# EAGLE design cartridge_pcb (EAGLE 9.5.2)
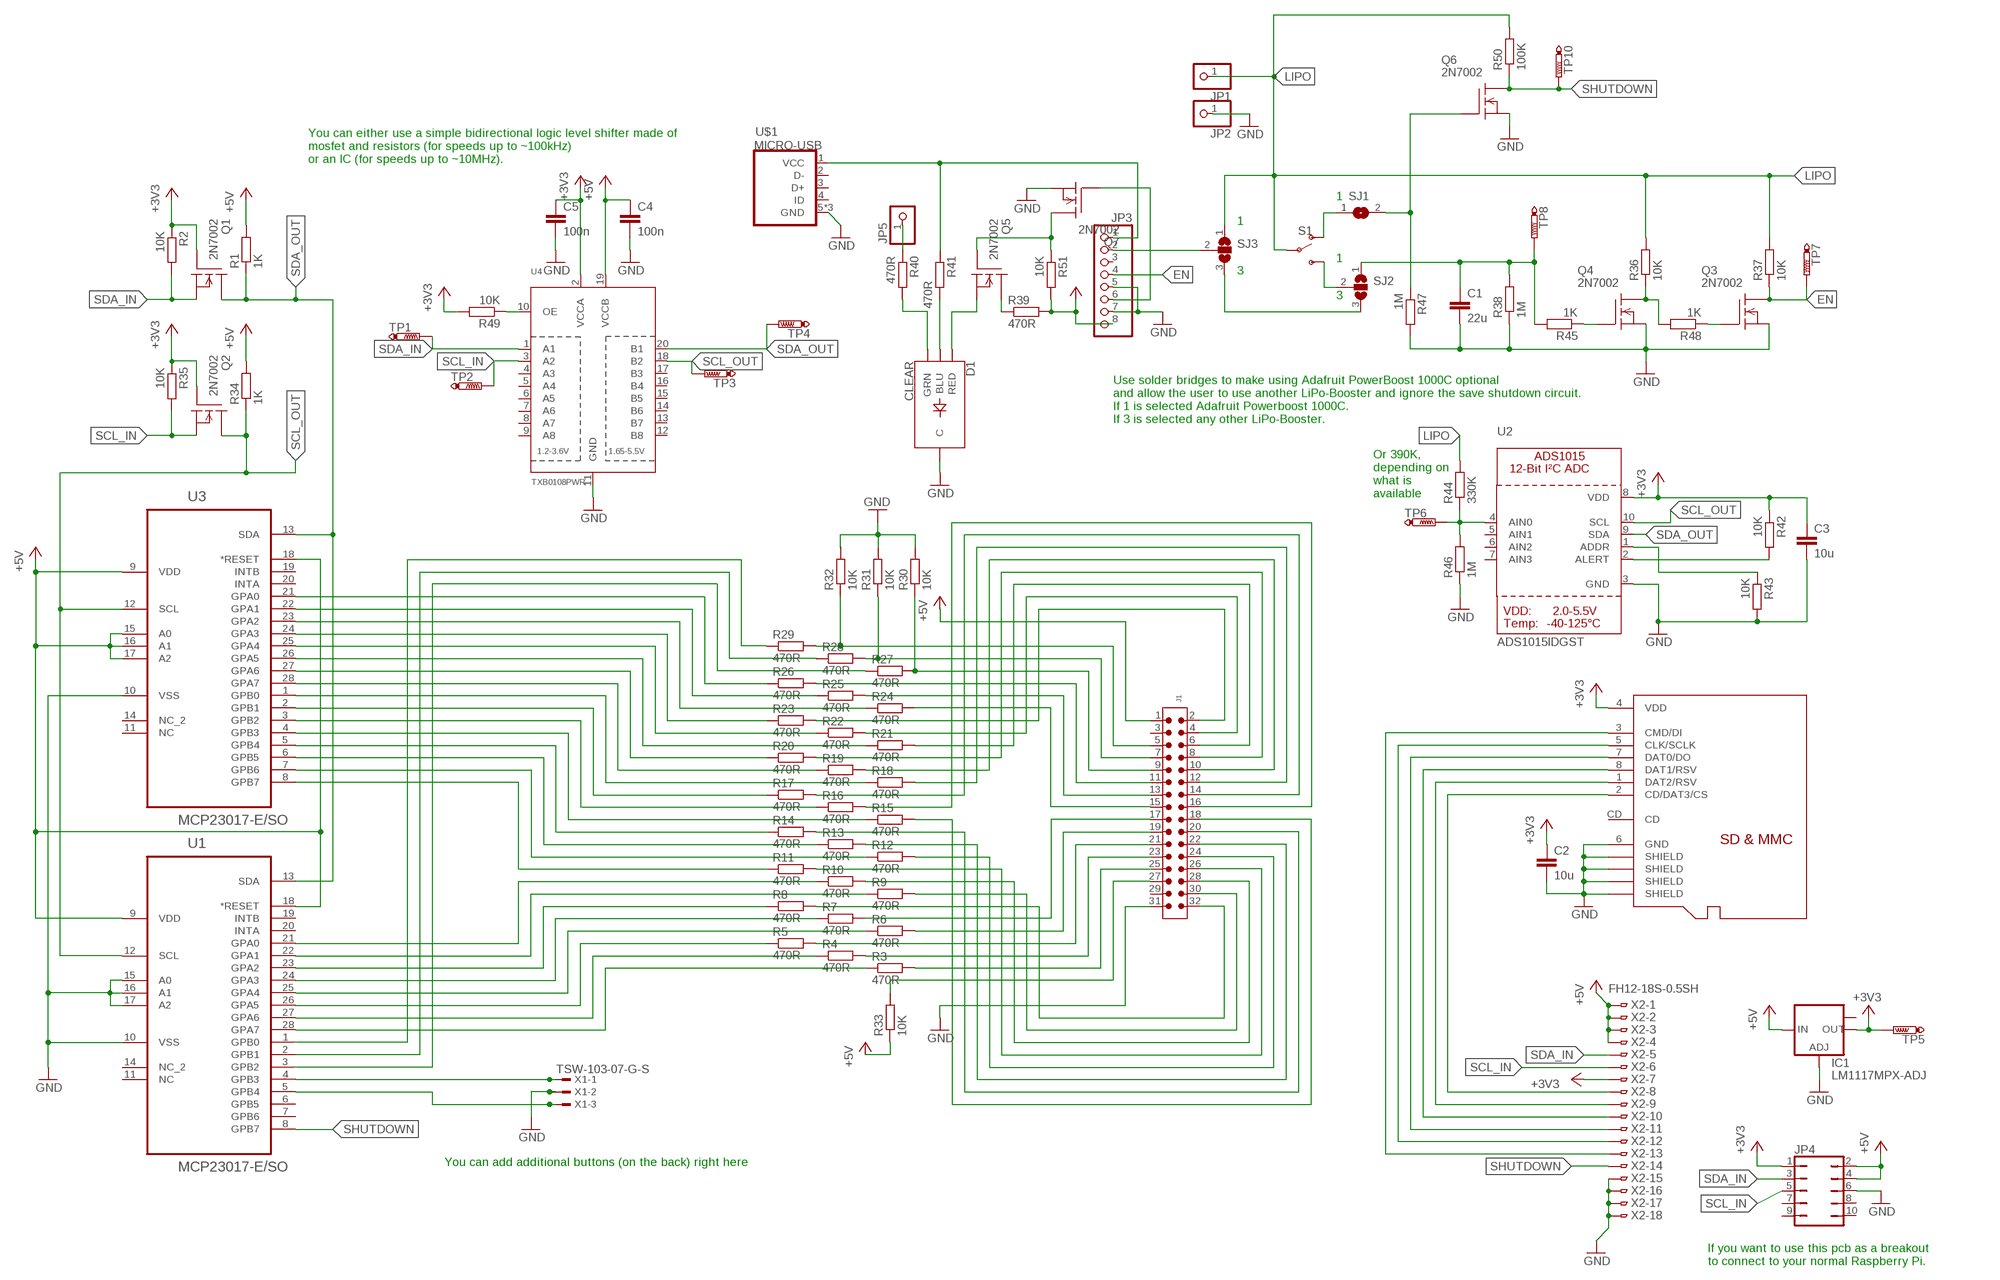
[diagram p0: schematic, sheet 1]

## Parts
C1  22u  C-EUC0805  [C0805]
C2  10u  C-EUC0805  [C0805]
C3  10u  C-EUC0805  [C0805]
C4  100n  C-EUC0805  [C0805]
C5  100n  C-EUC0805  [C0805]
D1  CLEAR  LED-RGB-CCCLEAR  [LED-RGB-THRU]
IC1  LM1117MPX-ADJ  [SOT223]
J1  6130XX21121_61303221121  [61303221121]
JP1  PINHD-1X1  [1X01]
JP2  PINHD-1X1  [1X01]
JP3  HEADER-1X8ROUND  [1X08_ROUND]
JP4  JP5Q  [JP5Q]
JP5  PINHD-1X1  [1X01]
Q1  2N7002  [SOT23]
Q2  2N7002  [SOT23]
Q3  2N7002  [SOT23]
Q4  2N7002  [SOT23]
Q5  2N7002  [SOT23]
Q6  2N7002  [SOT23]
Q7  2N7002  [SOT23]
R1  1K  R-EU_R0805  [R0805]
R2  10K  R-EU_R0805  [R0805]
R3  470R  R-EU_R0805  [R0805]
R4  470R  R-EU_R0805  [R0805]
R5  470R  R-EU_R0805  [R0805]
R6  470R  R-EU_R0805  [R0805]
R7  470R  R-EU_R0805  [R0805]
R8  470R  R-EU_R0805  [R0805]
R9  470R  R-EU_R0805  [R0805]
R10  470R  R-EU_R0805  [R0805]
R11  470R  R-EU_R0805  [R0805]
R12  470R  R-EU_R0805  [R0805]
R13  470R  R-EU_R0805  [R0805]
R14  470R  R-EU_R0805  [R0805]
R15  470R  R-EU_R0805  [R0805]
R16  470R  R-EU_R0805  [R0805]
R17  470R  R-EU_R0805  [R0805]
R18  470R  R-EU_R0805  [R0805]
R19  470R  R-EU_R0805  [R0805]
R20  470R  R-EU_R0805  [R0805]
R21  470R  R-EU_R0805  [R0805]
R22  470R  R-EU_R0805  [R0805]
R23  470R  R-EU_R0805  [R0805]
R24  470R  R-EU_R0805  [R0805]
R25  470R  R-EU_R0805  [R0805]
R26  470R  R-EU_R0805  [R0805]
R27  470R  R-EU_R0805  [R0805]
R28  470R  R-EU_R0805  [R0805]
R29  470R  R-EU_R0805  [R0805]
R30  10K  R-EU_R0805  [R0805]
R31  10K  R-EU_R0805  [R0805]
R32  10K  R-EU_R0805  [R0805]
R33  10K  R-EU_R0805  [R0805]
R34  1K  R-EU_R0805  [R0805]
R35  10K  R-EU_R0805  [R0805]
R36  10K  R-EU_R0805  [R0805]
R37  10K  R-EU_R0805  [R0805]
R38  1M  R-EU_R0805  [R0805]
R39  470R  R-EU_R0805  [R0805]
R40  470R  R-EU_R0805  [R0805]
R41  470R  R-EU_R0805  [R0805]
R42  10K  R-EU_R0805  [R0805]
R43  10K  R-EU_R0805  [R0805]
R44  330K  R-EU_R0805  [R0805]
R45  1K  R-EU_R0805  [R0805]
R46  1M  R-EU_R0805  [R0805]
R47  1M  R-EU_R0805  [R0805]
R48  1K  R-EU_R0805  [R0805]
R49  10K  R-EU_R0805  [R0805]
R50  100K  R-EU_R0805  [R0805]
R51  10K  R-EU_R0805  [R0805]
S1  SWITCH-SPDT-PTH-8.6X4.3MM-LOCK  [SWITCH_SPDT_8.6X4.3MM_LOCK]
SJ1  SJ  [SJ]
SJ2  SJ2W  [SJ_2]
SJ3  SJ2W  [SJ_2]
TP1  PTR1TP10R  [TP10R]
TP2  PTR1TP10R  [TP10R]
TP3  PTR1TP10R  [TP10R]
TP4  PTR1TP10R  [TP10R]
TP5  PTR1TP10R  [TP10R]
TP6  PTR1TP10R  [TP10R]
TP7  PTR1TP10R  [TP10R]
TP8  PTR1TP10R  [TP10R]
TP10  PTR1TP10R  [TP10R]
U1  MCP23017-E/SO  [SOIC127P1032X265-28N]
U2  ADS1015IDGST  ADC_ADS1015  [MSOP10]
U3  MCP23017-E/SO  [SOIC127P1032X265-28N]
U4  TXB0108PWR  [TSSOP20]
U$1  MICRO-USB  [MICRO-USB]
U$2  MICROSD  [C12075]
X1  TSW-103-07-G-S  [TSW-103-XX-G-S]
X2  FH12-18S-0.5SH  [FH12-18S-0.5SH]

## Nets
+3V3: C2.1 C3.1 C5.1 IC1.2(OUT) JP4.1 Q1.1(G) Q2.1(G) R2.1 R35.1 R42.1 R49.2 TP5.TP U2.8(VDD) U4.2(VCCA) U$2.4(VDD) X2.7
+5V: C4.1 IC1.3(IN) J1.1 JP3.8 JP4.2 JP4.4 R1.2 R33.1 R34.2 R39.2 R51.2 U1.9(VDD) U1.18(*RESET) U3.9(VDD) U3.15(A0) U3.16(A1) U3.17(A2) U3.18(*RESET) U4.19(VCCB) X2.1 X2.2 X2.3 X2.4
EN: JP3.4 Q3.3(D) R37.1 TP7.TP
GND: C1.2 C2.2 C3.2 C4.2 C5.2 D1.2(C) IC1.1(ADJ) J1.31 JP2.1 JP3.5 JP3.7 JP4.6 Q3.2(S) Q4.2(S) Q6.2(S) Q7.2(S) R30.2 R31.2 R32.2 R38.1 R43.2 R46.1 R47.2 U1.10(VSS) U1.15(A0) U1.16(A1) U1.17(A2) U2.3(GND) U3.10(VSS) U4.11(GND) U$1.5(GND) U$1.GND1(GND) U$1.GND2(GND) U$2.6(GND) U$2.GND@1(SHIELD) U$2.GND@2(SHIELD) U$2.GND@3(SHIELD) U$2.GND@4(SHIELD) X1.2 X2.15 X2.16 X2.17 X2.18
LIPO: JP1.1 R36.2 R37.2 R44.2 R50.2 S1.2(P) SJ3.1
N$1: R12.1 U3.7(GPB6)
N$2: R11.1 U3.8(GPB7)
N$3: R10.1 U1.21(GPA0)
N$4: R3.1 U1.28(GPA7)
N$5: R13.1 U3.6(GPB5)
N$6: R14.1 U3.5(GPB4)
N$7: R15.1 U3.4(GPB3)
N$8: R16.1 U3.3(GPB2)
N$9: R17.1 U3.2(GPB1)
N$10: R18.1 U3.1(GPB0)
N$11: R19.1 U3.28(GPA7)
N$12: R20.1 U3.27(GPA6)
N$13: R21.1 U3.26(GPA5)
N$14: R22.1 U3.25(GPA4)
N$15: R23.1 U3.24(GPA3)
N$16: R24.1 U3.23(GPA2)
N$17: R25.1 U3.22(GPA1)
N$18: R26.1 U3.21(GPA0)
N$19: R9.1 U1.22(GPA1)
N$20: R8.1 U1.23(GPA2)
N$21: R7.1 U1.24(GPA3)
N$22: R6.1 U1.25(GPA4)
N$23: R5.1 U1.26(GPA5)
N$24: R4.1 U1.27(GPA6)
N$25: J1.25 R3.2
N$26: J1.23 R4.2
N$27: J1.19 R6.2
N$28: J1.21 R5.2
N$30: J1.32 R8.2
N$31: J1.30 R9.2
N$32: J1.28 R10.2
N$33: J1.26 R11.2
N$34: J1.24 R12.2
N$35: J1.22 R13.2
N$36: J1.20 R14.2
N$37: J1.18 R15.2
N$38: J1.16 R16.2
N$39: J1.14 R17.2
N$40: J1.12 R18.2
N$41: J1.10 R19.2
N$42: J1.8 R20.2
N$43: J1.6 R21.2
N$44: J1.11 R26.2
N$45: J1.13 R25.2
N$46: J1.15 R24.2
N$47: Q5.1(G) Q7.3(D) R51.1
N$48: J1.17 R7.2
N$49: J1.9 R27.2 R30.1
N$50: J1.2 R23.2
N$51: J1.5 R29.2 R32.1
N$52: J1.27 R33.2
N$53: R44.1 R46.2 TP6.TP U2.4(AIN0)
N$54: R43.1 U2.1(ADDR)
N$55: U$2.7(DAT0/DO) X2.11
N$56: J1.4 R22.2
N$57: JP3.6 Q7.1(G)
N$58: R27.1 U1.3(GPB2)
N$59: R28.1 U1.2(GPB1)
N$60: R29.1 U1.1(GPB0)
N$61: U$2.8(DAT1/RSV) X2.10
N$62: U$2.1(DAT2/RSV) X2.9
N$63: Q4.3(D) R36.1 R48.2
N$64: JP5.1 R40.1
N$65: U$2.2(CD/DAT3/CS) X2.8
N$66: C1.1 R38.2 R45.2 SJ2.1 TP8.TP
N$67: U$2.5(CLK/SCLK) X2.12
N$68: U$2.3(CMD/DI) X2.13
N$69: Q5.3(D) R39.1
N$70: J1.7 R28.2 R31.1
N$71: D1.4(BLU) R41.2
N$73: D1.3(GRN) R40.2
N$74: D1.1(RED) Q5.2(S)
N$76: Q3.1(G) R48.1
N$77: R42.2 U2.2(ALERT)
N$78: Q4.1(G) R45.1
N$79: S1.3(S) SJ2.2
N$80: S1.1(O) SJ1.1
N$81: JP3.2 SJ3.2
N$82: SJ2.3 SJ3.3
N$83: JP3.1 R41.1 U$1.1(VCC)
N$84: R49.1 U4.10(OE)
N$85: U1.4(GPB3) X1.1
N$86: U1.5(GPB4) X1.3
SCL_IN: JP4.5 Q2.2(S) R35.2 TP2.TP U4.3(A2) X2.6
SCL_OUT: Q2.3(D) R34.1 TP3.TP U1.12(SCL) U2.10(SCL) U3.12(SCL) U4.18(B2)
SDA_IN: JP4.3 Q1.2(S) R2.2 TP1.TP U4.1(A1) X2.5
SDA_OUT: Q1.3(D) R1.1 TP4.TP U1.13(SDA) U2.9(SDA) U3.13(SDA) U4.20(B1)
SHUTDOWN: Q6.3(D) R50.1 TP10.TP U1.8(GPB7) X2.14
SHUTDOWN_OLD: Q6.1(G) R47.1 SJ1.2
Unconnected: IC1.TAB(OUT1) J1.3 J1.29 JP3.3 JP4.7 JP4.8 JP4.9 JP4.10 U1.6(GPB5) U1.7(GPB6) U1.11(NC) U1.14(NC_2) U1.19(INTB) U1.20(INTA) U2.5(AIN1) U2.6(AIN2) U2.7(AIN3) U3.11(NC) U3.14(NC_2) U3.19(INTB) U3.20(INTA) U4.4(A3) U4.5(A4) U4.6(A5) U4.7(A6) U4.8(A7) U4.9(A8) U4.12(B8) U4.13(B7) U4.14(B6) U4.15(B5) U4.16(B4) U4.17(B3) U$1.2(D-) U$1.3(D+) U$1.4(ID) U$2.CD

## Notes on the sheet
- You can either use a simple bidirectional logic level shifter made of 
  mosfet and resistors (for speeds up to ~100kHz) 
  or an IC (for speeds up to ~10MHz).
- 1
- 1
- 1
- 3
- 3
- Use solder bridges to make using Adafruit PowerBoost 1000C optional
  and allow the user to use another LiPo-Booster and ignore the save shutdown circuit.
  If 1 is selected Adafruit Powerboost 1000C.
  If 3 is selected any other LiPo-Booster.
- Or 390K,
  depending on
  what is
  available
- You can add additional buttons (on the back) right here
- If you want to use this pcb as a breakout
  to connect to your normal Raspberry Pi.

## Library data of the parts
C1-C5 = rcl:C-EU: CAPACITOR, European symbol; SPICEPREFIX: C
D1 = SparkFun-LED:LED-RGB-CC: LED-RGB Common Cathode Packages: LED RGB-THRU LED_PIRANHA_5MM SparkFun Products: RGB Diffused Common Cathode- Diffuse <[https://www.sparkfun.com/products/9264]> RGB Diffused Common Cathode - Clear <[https://www.sparkfun.com/products/105]> LED-RGB 5mm Square (Piranha) <[https://www.sparkfun.com/products/11679]>; PROD_ID: DIO-08418
IC1 = lm1117:LM1117MPX-ADJ
J1 = Eagle_WR-PHD (rev19a):6130XX21121_61303221121: WR-PHD 2.54 mm THT Dual Pin Header ARTICLE PROPERTIES: Pins:4;​ 6;​ 8;​ 10;​ 12;​ 14;​ 16;​ 18;​ 20;​ 22;​ 24;​ 26;​ 28;​ 30;​ 32;​ 34;​ 36;​ 40;​ 44;​ 64;​ 72;​ 80 KIND PROPERTIES: Pitch：2.54 mm Quality Class:3 as per CECC 75 301-802 Rows：Dual Gender：Pin Header Type：Board Stacker MATERIAL PROPERTIES: Insulator Material :PA6T Insulator Flammability Rating:UL94 V-0 Contact Material:Copper Alloy Contact Plating:Gold Contact Type:Stamped GENERAL INFORMATION Operating Temperature:-40 up to +105 °C Compliance:Lead free / RoHS ELECTRICAL PROPERTIES: Rated Current:3 A IR 1:3 A Withstanding Voltage:500 V (AC) Contact Resistance:20 mΩ RISO:1000 MΩ CERTIFICATION UL Approval:E323964 PACKAGING PROPERTIES Packaging:Bag <https://katalog.we-online.com/media/images/v2/o33215v209%20Family_WR-PHD_6130xx21121.jpg> Details see: https://katalog.we-online.com/en/em/PHD_2_54_THT_DUAL_PIN_HEADER_6130XX21121 Updated by Yingchun,Shan 2019-10-16 2019 (C) Würth Elektronik; DATASHEET-URL: https://katalog.we-online.com/em/datasheet/61303221121.pdf; GENDER: Pin Header; IR: 3A; MATES: WR-PHD 2.54mm Angled DualSocket Header/Dual Socket Header/Dual Socket Header Bottom Entry/Dual Socket Header Bottom Entry Large/SMT Dual Socket Header/SMT Dual Socket Header Bottom Entry; PACKAGING: Bag; PART-NUMBER: 61303221121; PINS: 32; ROWS: Dual; TYPE: Board Stacker
JP1 JP2 JP5 = adafruit:PINHD-1X1: Pin header 1x1 for 0.1" spacing With round pins
JP3 = microbuilder:HEADER-1X8: PIN HEADER
JP4 = jumper:JP5Q: JUMPER
Q1-Q7 = transistors_gaui:2N7002
R1-R51 = rcl:R-EU_: RESISTOR, European symbol; SPICEPREFIX: R
S1 = SparkFun-Switches:SWITCH-SPDT: Single Pole, Double Throw (SPDT) Switch Single-pole, double-throw (SPDT) switch. Variant Overview SMD-AYZ0202 Surface Mount DPDT Switch <https://www.sparkfun.com/products/597> (COM-00597) Used on e.g. LilyPad Arduino USB - ATmega32U4 Board <https://www.sparkfun.com/products/12049> PTH-11.6X4.0MM SPDT Mini Power Switch <https://www.sparkfun.com/products/102> (COM-00102) Used on e.g. SparkFun Simon Says - Through-Hole Soldering Kit <https://www.sparkfun.com/products/10547> (KIT-10547) PTH-11.6X4.0MM-KIT KIT version of SPDT Mini Power Switch - Simplifies soldering by removing tStop of switch pins - only one side can be soldered. PTH-11.6X4.0MM-LOCK LOCK version of SPDT Mini Power Switch - Offset pins hold switch in place for easier soldering. SMD-RIGHT-ANGLE Surface Mount Right Angle Switch <https://www.sparkfun.com/products/10860> (COM-10860) Used on e.g. SparkFun ESP8266 Thing <https://www.sparkfun.com/products/13231>; PROD_ID: SWCH-14746
SJ1 = jumper:SJ: SMD solder JUMPER
SJ2 SJ3 = jumper:SJ2W: SMD solder JUMPER
TP1-TP8 TP10 = testpad:PTR1: TEST PIN
U1 U3 = MCP23017-ESO:MCP23017-E/SO: IC, 16-Bit I/O Expander with Serial Interface, SOIC-28; MPN: MCP23017-E/SO; OC_FARNELL: 1332087; OC_NEWARK: 34M7442; PACKAGE: SOIC-28; SUPPLIER: Microchip
U2 = microbuilder:ADC_ADS1015: ADS1015 - 12-bit 4-Channel I2C ADC with Internal PGA VDD: 2.0-5.5V Sampling Rate: 3.3ksps Gain Settings: 2/3, 1, 2, 4, 8, 16 I2C Address: ADDR low = 1001000x, ADDR high = 1001001x Internal Comparator The ADS1015 includes an internal comparator that can be set to output a high-level on ALERT when the conversion results exceeeds a pre-defined upper level, and will deassert itself when the level falls below a pre-defined lower threshold level. It can also be set to windowed mode where the ALERT pin will be asserted if the data exceeds the upper threshold or falls below the lower threshold.
U4 = microbuilder:TXB0108PWR: 8-Bit Bi-Directional Level Shifter 1.2V-3.6V (VCCA) to 1.65V-5.5V (VCCB) bi-directional level shifter with auto direction sensing. Max data rate - VCCA 1.8V: 20Mbps (50ns), VCCA 3.3V: 100Mbps (10ns) Digikey: 296-21527-1-ND
U$1 = microusb:MICRO-USB: Micro USB B connector
U$2 = micro-sd:MICROSD: Micro-SD / Transflash card holder with SPI pinout For the 3M # 2908-05WB-MG and/or 4UCON #19656 push-push type
X1 = con-samtec:TSW-103-*-G-S: THROUGH-HOLE .025" SQ POST HEADER Source: Samtec TSW.pdf; MF: Samtec Inc.; MPN: TSW-103-07-G-S
X2 = con-hirose:FH12-18S-0.5S: 0.5mm Pitch Connectors For FPC/FFC Source: Data sheet <http://www.hirose.co.jp/cataloge_hp/e58605370.pdf>; MPN: FH12-18S-0.5SH(55); OC_FARNELL: 1324547; OC_NEWARK: 34M6164

## Board
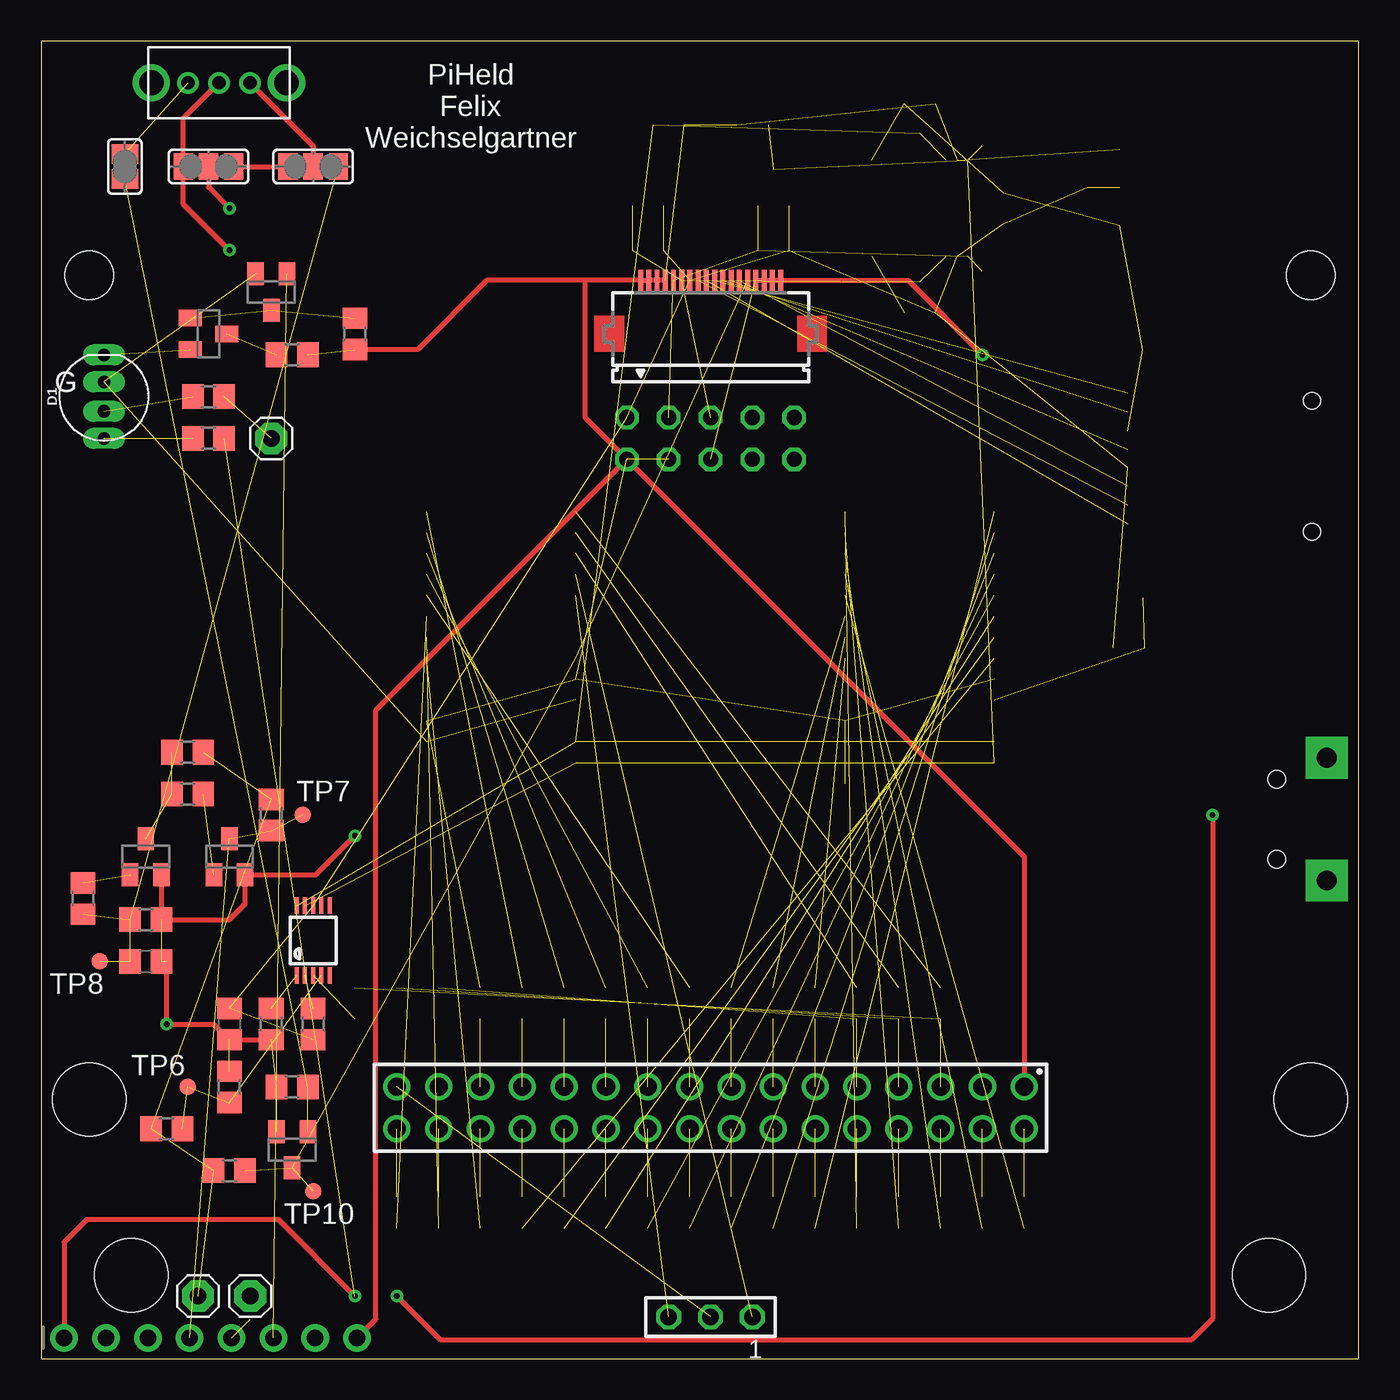
[diagram p1: board, top side]
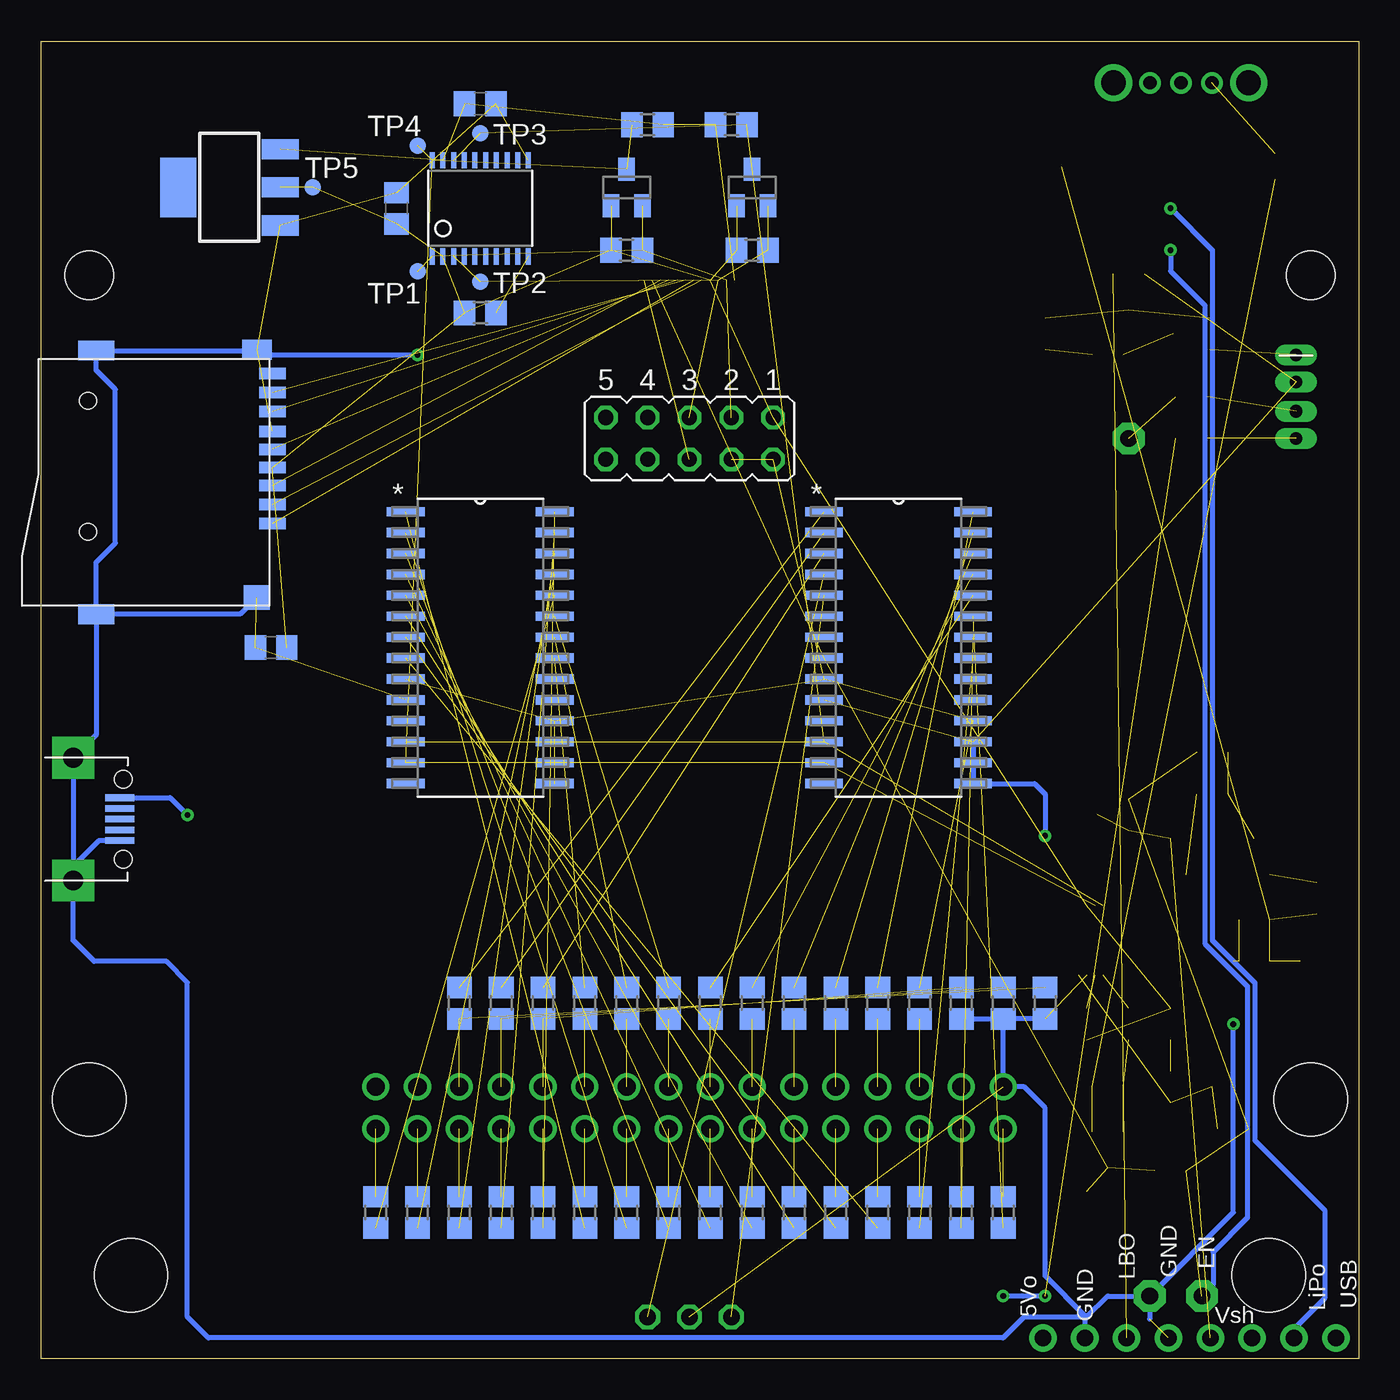
[diagram p2: board, bottom side, seen from below]

Size 80 x 80 mm. Coordinates in mm from the lower left corner, seen from the top.
Outline: 0,0 80,0 80,80 0,80 0,0
Copper layers (1*16): Top 0.035mm / dielectric 1.5mm / Bottom 0.035mm
Design rules "default": minimum track width 6mil, minimum drill 0.35mm, track to track 6mil, track to pad 6mil, pad to pad 6mil, via to via 6mil, smd to smd 6mil, copper to edge 40mil, drill to drill 6mil, minimum pad ring 10mil, minimum via ring 8mil, stop-mask expansion 4mil, vias tented up to drill 0mil, thermal gap 10mil
Holes 4.45 mm at 74.55,5.08 77.09,15.75 5.46,5.08 2.92,15.75
Holes 2.92 mm at 77.09,65.79 2.92,65.79

### Footprints (pad centres in the part's own frame; a part is rotated, then mirrored left to right if it is on the bottom)
C0805 = smd 1.3 x 1.5: 1 -0.95,0; 2 0.95,0
LED-RGB-THRU = drill 0.762 pad 0.889 long: 1 2.54,0; 2 0.889,0; 3 -0.889,0; 4 -2.54,0
SOT223 = smd 1.219 x 2.235: 1 -2.311,-3.099; 2 0,-3.099; 3 2.311,-3.099 | smd 3.6 x 2.2: TAB 0,3.099
61303221121 = drill 1.1: 1 -19.05,-1.27; 2 -19.05,1.27; 3 -16.51,-1.27; 4 -16.51,1.27; 5 -13.97,-1.27; 6 -13.97,1.27; 7 -11.43,-1.27; 8 -11.43,1.27; 9 -8.89,-1.27; 10 -8.89,1.27; 11 -6.35,-1.27; 12 -6.35,1.27; 13 -3.81,-1.27; 14 -3.81,1.27; 15 -1.27,-1.27; 16 -1.27,1.27; 17 1.27,-1.27; 18 1.27,1.27; 19 3.81,-1.27; 20 3.81,1.27; 21 6.35,-1.27; 22 6.35,1.27; 23 8.89,-1.27; 24 8.89,1.27; 25 11.43,-1.27; 26 11.43,1.27; 27 13.97,-1.27; 28 13.97,1.27; 29 16.51,-1.27; 30 16.51,1.27; 31 19.05,-1.27; 32 19.05,1.27
1X01 = drill 1.016 pad 1.93 octagon: 1 0,0
1X08_ROUND = drill 1 pad 1.676: 1 -8.89,0; 2 -6.35,0; 3 -3.81,0; 4 -1.27,0; 5 1.27,0; 6 3.81,0; 7 6.35,0; 8 8.89,0
JP5Q = drill 0.914 octagon: 1 -5.08,-1.27; 2 -5.08,1.27; 3 -2.54,-1.27; 4 -2.54,1.27; 5 0,-1.27; 6 0,1.27; 7 2.54,-1.27; 8 2.54,1.27; 9 5.08,-1.27; 10 5.08,1.27
SOT23 = smd 1 x 1.4: 1 -0.95,-1.1; 2 0.95,-1.1; 3 0,1.1
R0805 = smd 1.3 x 1.5: 1 -0.95,0; 2 0.95,0
SWITCH_SPDT_8.6X4.3MM_LOCK = drill 0.8: 1 -1.88,0; 2 0,0; 3 1.88,0 | drill 1.5: 4 -4.1,0; 5 4.1,0
SJ = smd 1.168 x 1.6: 1 -0.762,0; 2 0.762,0
SJ_2 = smd 1.168 x 1.6: 1 -1.524,0; 2 0,0; 3 1.524,0
TP10R = smd 1 x 1: TP 0,0
SOIC127P1032X265-28N = smd 2.286 x 0.559: 1 -4.521,8.255; 2 -4.521,6.985; 3 -4.521,5.715; 4 -4.521,4.445; 5 -4.521,3.175; 6 -4.521,1.905; 7 -4.521,0.635; 8 -4.521,-0.635; 9 -4.521,-1.905; 10 -4.521,-3.175; 11 -4.521,-4.445; 12 -4.521,-5.715; 13 -4.521,-6.985; 14 -4.521,-8.255; 15 4.521,-8.255; 16 4.521,-6.985; 17 4.521,-5.715; 18 4.521,-4.445; 19 4.521,-3.175; 20 4.521,-1.905; 21 4.521,-0.635; 22 4.521,0.635; 23 4.521,1.905; 24 4.521,3.175; 25 4.521,4.445; 26 4.521,5.715; 27 4.521,6.985; 28 4.521,8.255
MSOP10 = smd 0.25 x 1: 1 -1,-2.113; 2 -0.5,-2.113; 3 0,-2.113; 4 0.5,-2.113; 5 1,-2.113; 6 1,2.113; 7 0.5,2.113; 8 0,2.113; 9 -0.5,2.113; 10 -1,2.113
TSSOP20 = smd 0.305 x 0.991: 1 -2.925,-2.918; 2 -2.275,-2.918; 3 -1.625,-2.918; 4 -0.975,-2.918; 5 -0.325,-2.918; 6 0.325,-2.918; 7 0.975,-2.918; 8 1.625,-2.918; 9 2.275,-2.918; 10 2.925,-2.918; 11 2.925,2.918; 12 2.275,2.918; 13 1.625,2.918; 14 0.975,2.918; 15 0.325,2.918; 16 -0.325,2.918; 17 -0.975,2.918; 18 -1.625,2.918; 19 -2.275,2.918; 20 -2.925,2.918
MICRO-USB = smd 0.4 x 1.75: 1 -1.3,4.525; 2 -0.65,4.525; 3 0,4.525; 4 0.65,4.525; 5 1.3,4.525 | drill 1.2 pad 2.54 square: GND1 -3.725,1.7; GND2 3.725,1.7 | hole 1.05: -2.425,4.73; 2.425,4.73
C12075 = smd 0.7 x 1.6: 1 2.5,7.7; 2 1.35,7.7; 3 0.2,7.7; 4 -0.9,7.7; 5 -2,7.7; 6 -3.1,7.7; 7 -4.3,7.7; 8 -5.45,7.7; CD -6.6,7.7 | smd 1.2 x 1.8: GND@1 -8.05,6.77 | smd 1.2 x 2.2: GND@2 -8,-3; GND@4 8,-3 | smd 1.5 x 1.6: GND@3 6.99,6.75 | hole 1: -4.95,-3.5; 3,-3.5; 3,-3.5
TSW-103-XX-G-S = drill 1 pad 1.5 octagon: 1 2.54,0; 2 0,0; 3 -2.54,0
FH12-18S-0.5SH = smd 0.3 x 1.3: 1 -4.25,3.25; 2 -3.75,3.25; 3 -3.25,3.25; 4 -2.75,3.25; 5 -2.25,3.25; 6 -1.75,3.25; 7 -1.25,3.25; 8 -0.75,3.25; 9 -0.25,3.25; 10 0.25,3.25; 11 0.75,3.25; 12 1.25,3.25; 13 1.75,3.25; 14 2.25,3.25; 15 2.75,3.25; 16 3.25,3.25; 17 3.75,3.25; 18 4.25,3.25

### Placement (x,y rotation side)
C1  6.35,24.13 0 top
C2  66.04,43.18 180 bottom
C3  11.43,20.32 270 top
C4  53.34,76.2 0 bottom
C5  58.42,69.85 90 bottom
D1  3.81,58.42 90 top
IC1  68.58,71.12 90 bottom
J1  40.64,15.24 180 top
JP1  9.53,3.81 0 top
JP2  12.7,3.81 0 top
JP3  10.29,1.27 0 top
JP4  40.64,55.88 180 bottom
JP5  13.97,55.88 0 top
Q1  44.45,71.12 0 bottom
Q2  36.83,71.12 0 bottom
Q3  11.43,30.48 0 top
Q4  6.35,30.48 0 top
Q5  10.16,62.23 270 top
Q6  15.24,12.7 180 top
Q7  13.97,64.77 180 top
R1  43.18,74.93 0 bottom
R2  44.45,67.31 0 bottom
R3  29.21,21.59 270 bottom
R4  31.75,21.59 270 bottom
R5  34.29,21.59 270 bottom
R6  36.83,21.59 270 bottom
R7  39.37,21.59 270 bottom
R8  21.59,8.89 90 bottom
R9  24.13,8.89 90 bottom
R10  26.67,8.89 90 bottom
R11  29.21,8.89 90 bottom
R12  31.75,8.89 90 bottom
R13  34.29,8.89 90 bottom
R14  36.83,8.89 90 bottom
R15  39.37,8.89 90 bottom
R16  41.91,8.89 90 bottom
R17  44.45,8.89 90 bottom
R18  46.99,8.89 90 bottom
R19  49.53,8.89 90 bottom
R20  52.07,8.89 90 bottom
R21  54.61,8.89 90 bottom
R22  57.15,8.89 90 bottom
R23  59.69,8.89 90 bottom
R24  41.91,21.59 270 bottom
R25  44.45,21.59 270 bottom
R26  46.99,21.59 270 bottom
R27  49.53,21.59 270 bottom
R28  52.07,21.59 270 bottom
R29  54.61,21.59 270 bottom
R30  24.13,21.59 270 bottom
R31  21.59,21.59 270 bottom
R32  19.05,21.59 270 bottom
R33  26.67,21.59 270 bottom
R34  38.1,74.93 180 bottom
R35  36.83,67.31 0 bottom
R36  8.89,36.83 0 top
R37  13.97,33.02 90 top
R38  6.35,26.67 180 top
R39  15.24,60.96 0 top
R40  10.16,58.42 180 top
R41  10.16,55.88 180 top
R42  16.51,20.32 90 top
R43  13.97,20.32 270 top
R44  7.62,13.97 180 top
R45  2.54,27.94 270 top
R46  11.43,16.51 270 top
R47  15.24,16.51 180 top
R48  8.89,34.29 180 top
R49  53.34,63.5 180 bottom
R50  11.43,11.43 180 top
R51  19.05,62.23 270 top
S1  10.79,77.47 0 top
SJ1  5.08,72.39 270 top
SJ2  16.51,72.39 180 top
SJ3  10.16,72.39 0 top
TP1  57.15,66.04 0 bottom
TP2  53.34,65.41 0 bottom
TP3  53.34,74.42 0 bottom
TP4  57.15,73.66 0 bottom
TP5  63.5,71.12 0 bottom
TP6  8.89,16.51 0 top
TP7  15.88,33.02 0 top
TP8  3.56,24.13 0 top
TP10  16.51,10.16 0 top
U1  27.94,43.18 0 bottom
U2  16.51,25.4 0 top
U3  53.34,43.18 0 bottom
U4  53.34,69.85 0 bottom
U$1  79.76,32.77 270 bottom
U$2  73.66,53.21 270 bottom
X1  40.64,2.54 0 top
X2  40.64,62.23 0 top

### Tracks (layer width: path | path; a pad name or v marks a point on that pad's centre or on a via)
+3V3  (15 unrouted)
+5V  (15 unrouted)
  Top 0.305: X2.4 X2.3 X2.2 X2.1 33.02,65.48 | 33.02,65.48 27.06,65.48 22.86,61.28 R51.2 | JP4.2 33.02,57.15 33.02,65.48 | JP4.2 59.69,30.48 J1.1 | JP4.2 20.32,39.37 20.32,2.41 JP3.8
EN  (3 unrouted)
GND  (via drill 0.35)  (19 unrouted)
  Top 0.305: v57.15,60.96 52.63,65.48 X2.18 X2.17 X2.16 X2.15 | 7.62,24.13 v7.62,20.32 10.48,20.32 C3.2 R43.2 | Q4.2 R38.1 11.43,26.67 12.38,27.62 Q3.2 16.68,29.38 v19.05,31.75
  Bottom 0.305: U$1.GND2 78.06,29.91 76.5,31.47 U$1.5 | U$1.GND2 U$1.GND1 76.66,37.89 U$2.GND@4 | U$2.GND@3 67.92,45.21 U$2.GND@4 | U$2.GND@4 76.66,48.35 75.49,49.52 75.49,58.85 76.66,60.02 U$2.GND@2 66.94,61.21 U$2.GND@1 66.59,60.96 v57.15,60.96 | U1.17 U1.16 U1.15 19.68,34.92 19.05,34.29 v19.05,31.75 | 16.54,2.52 15.24,3.81 JP2.1 | U$1.GND2 78.06,25.4 76.79,24.13 72.39,24.13 71.12,22.86 71.12,2.54 69.85,1.27 21.59,1.27 20.34,2.52 16.54,2.52 | R30.2 R31.2 | R31.2 R32.2 18.73,20.32 | R31.2 J1.31 20.32,16.51 19.05,15.24 19.05,5.03 16.54,2.52 | JP2.1 7.62,8.89 v7.62,20.32 | JP2.1 12.7,2.41 | 16.54,2.52 16.64,2.41 JP3.7
LIPO  (via drill 0.35)  (4 unrouted)
  Top 0.305: v11.43,67.31 8.64,70.1 SJ3.1 8.64,75.31 S1.2
  Bottom 0.305: v11.43,67.31 11.43,66.04 9.35,63.96 9.35,25.21 6.77,22.63 6.77,8.57 8.85,6.49 8.85,4.48 JP1.1
N$1  (1 unrouted)
N$2  (1 unrouted)
N$3  (1 unrouted)
N$4  (1 unrouted)
N$5  (1 unrouted)
N$6  (1 unrouted)
N$7  (1 unrouted)
N$8  (1 unrouted)
N$9  (1 unrouted)
N$10  (1 unrouted)
N$11  (1 unrouted)
N$12  (1 unrouted)
N$13  (1 unrouted)
N$14  (1 unrouted)
N$15  (1 unrouted)
N$16  (1 unrouted)
N$17  (1 unrouted)
N$18  (1 unrouted)
N$19  (1 unrouted)
N$20  (1 unrouted)
N$21  (1 unrouted)
N$22  (1 unrouted)
N$23  (1 unrouted)
N$24  (1 unrouted)
N$25  (1 unrouted)
N$26  (1 unrouted)
N$27  (1 unrouted)
N$28  (1 unrouted)
N$30  (1 unrouted)
N$31  (1 unrouted)
N$32  (1 unrouted)
N$33  (1 unrouted)
N$34  (1 unrouted)
N$35  (1 unrouted)
N$36  (1 unrouted)
N$37  (1 unrouted)
N$38  (1 unrouted)
N$39  (1 unrouted)
N$40  (1 unrouted)
N$41  (1 unrouted)
N$42  (1 unrouted)
N$43  (1 unrouted)
N$44  (1 unrouted)
N$45  (1 unrouted)
N$46  (1 unrouted)
N$47  (2 unrouted)
N$48  (1 unrouted)
N$49  (2 unrouted)
N$50  (1 unrouted)
N$51  (2 unrouted)
N$52  (1 unrouted)
N$53  (3 unrouted)
N$54  (1 unrouted)
N$55  (1 unrouted)
N$56  (1 unrouted)
N$57  (1 unrouted)
N$58  (1 unrouted)
N$59  (1 unrouted)
N$60  (1 unrouted)
N$61  (1 unrouted)
N$62  (1 unrouted)
N$63  (2 unrouted)
N$64  (1 unrouted)
N$65  (1 unrouted)
N$66  (4 unrouted)
N$67  (1 unrouted)
N$68  (1 unrouted)
N$69  (1 unrouted)
N$70  (2 unrouted)
N$71  (1 unrouted)
N$73  (1 unrouted)
N$74  (1 unrouted)
N$76  (1 unrouted)
N$77  (1 unrouted)
N$78  (1 unrouted)
N$79
  Top 0.305: S1.3 16.51,73.64 SJ2.2
N$80  (1 unrouted)
N$81  (via drill 0.35)
  Top 0.305: SJ3.2 10.16,71.12 v11.43,69.85
  Bottom 0.305: v11.43,69.85 8.89,67.31 8.89,25.4 6.31,22.82 6.31,13.27 2.07,9.03 2.07,3.67 3.94,1.81 JP3.2
N$82
  Top 0.305: SJ3.3 SJ2.3
N$83  (via drill 0.35)  (1 unrouted)
  Top 0.305: v71.12,33.02 71.12,2.44 69.85,1.17 24.23,1.17 v21.59,3.81 | JP3.1 1.4,7.08 2.79,8.47 14.39,8.47 v19.05,3.81
  Bottom 0.305: U$1.1 72.17,34.07 v71.12,33.02 | v19.05,3.81 v21.59,3.81
N$84  (1 unrouted)
N$85  (1 unrouted)
N$86  (1 unrouted)
SCL_IN  (5 unrouted)
SCL_OUT  (6 unrouted)
SDA_IN  (5 unrouted)
SDA_OUT  (6 unrouted)
SHUTDOWN  (4 unrouted)
SHUTDOWN_OLD  (2 unrouted)

### Text on the board
bPlace: EN | GND | LBO | USB | LiPo | 5Vo | Vsh | GND
tNames: PiHeld / Felix / Weichselgartner | G